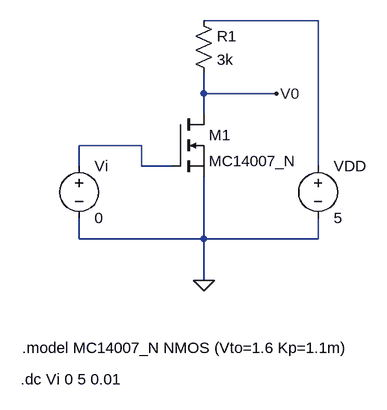
[diagram p0: schematic 1.2.1.asc]
1.2.1.asc, the LTspice schematic file:
Version 4
SHEET 1 880 680
WIRE 512 -176 336 -176
WIRE 336 -64 336 -96
WIRE 448 -64 336 -64
WIRE 336 -32 336 -64
WIRE 240 16 144 16
WIRE 144 48 144 16
WIRE 240 48 240 16
WIRE 288 48 240 48
WIRE 512 48 512 -176
WIRE 144 160 144 128
WIRE 336 160 336 64
WIRE 336 160 144 160
WIRE 512 160 512 128
WIRE 512 160 336 160
WIRE 336 224 336 160
FLAG 336 224 0
FLAG 448 -64 V0
SYMBOL voltage 144 32 R0
SYMATTR InstName Vi
SYMATTR Value 0
SYMBOL voltage 512 32 R0
SYMATTR InstName VDD
SYMATTR Value 5
SYMBOL nmos 288 -32 R0
SYMATTR InstName M1
SYMATTR Value MC14007_N
SYMBOL res 320 -192 R0
SYMATTR InstName R1
SYMATTR Value 3k
TEXT 56 328 Left 2 !.model MC14007_N NMOS (Vto=1.6 Kp=1.1m)
TEXT 54 376 Left 2 !.dc Vi 0 5 0.01

The netlist it stands for:
* 1.2.1.asc
Vi N002 0 0
VDD N001 0 5
M1 V0 N002 0 0 MC14007_N
R1 N001 V0 3k
.model NMOS NMOS
.model PMOS PMOS
.lib standard.mos
.model MC14007_N NMOS (Vto=1.6 Kp=1.1m)
.dc Vi 0 5 0.01
.backanno
.end